# EAGLE design WaterTemp (EAGLE 9.5.0)
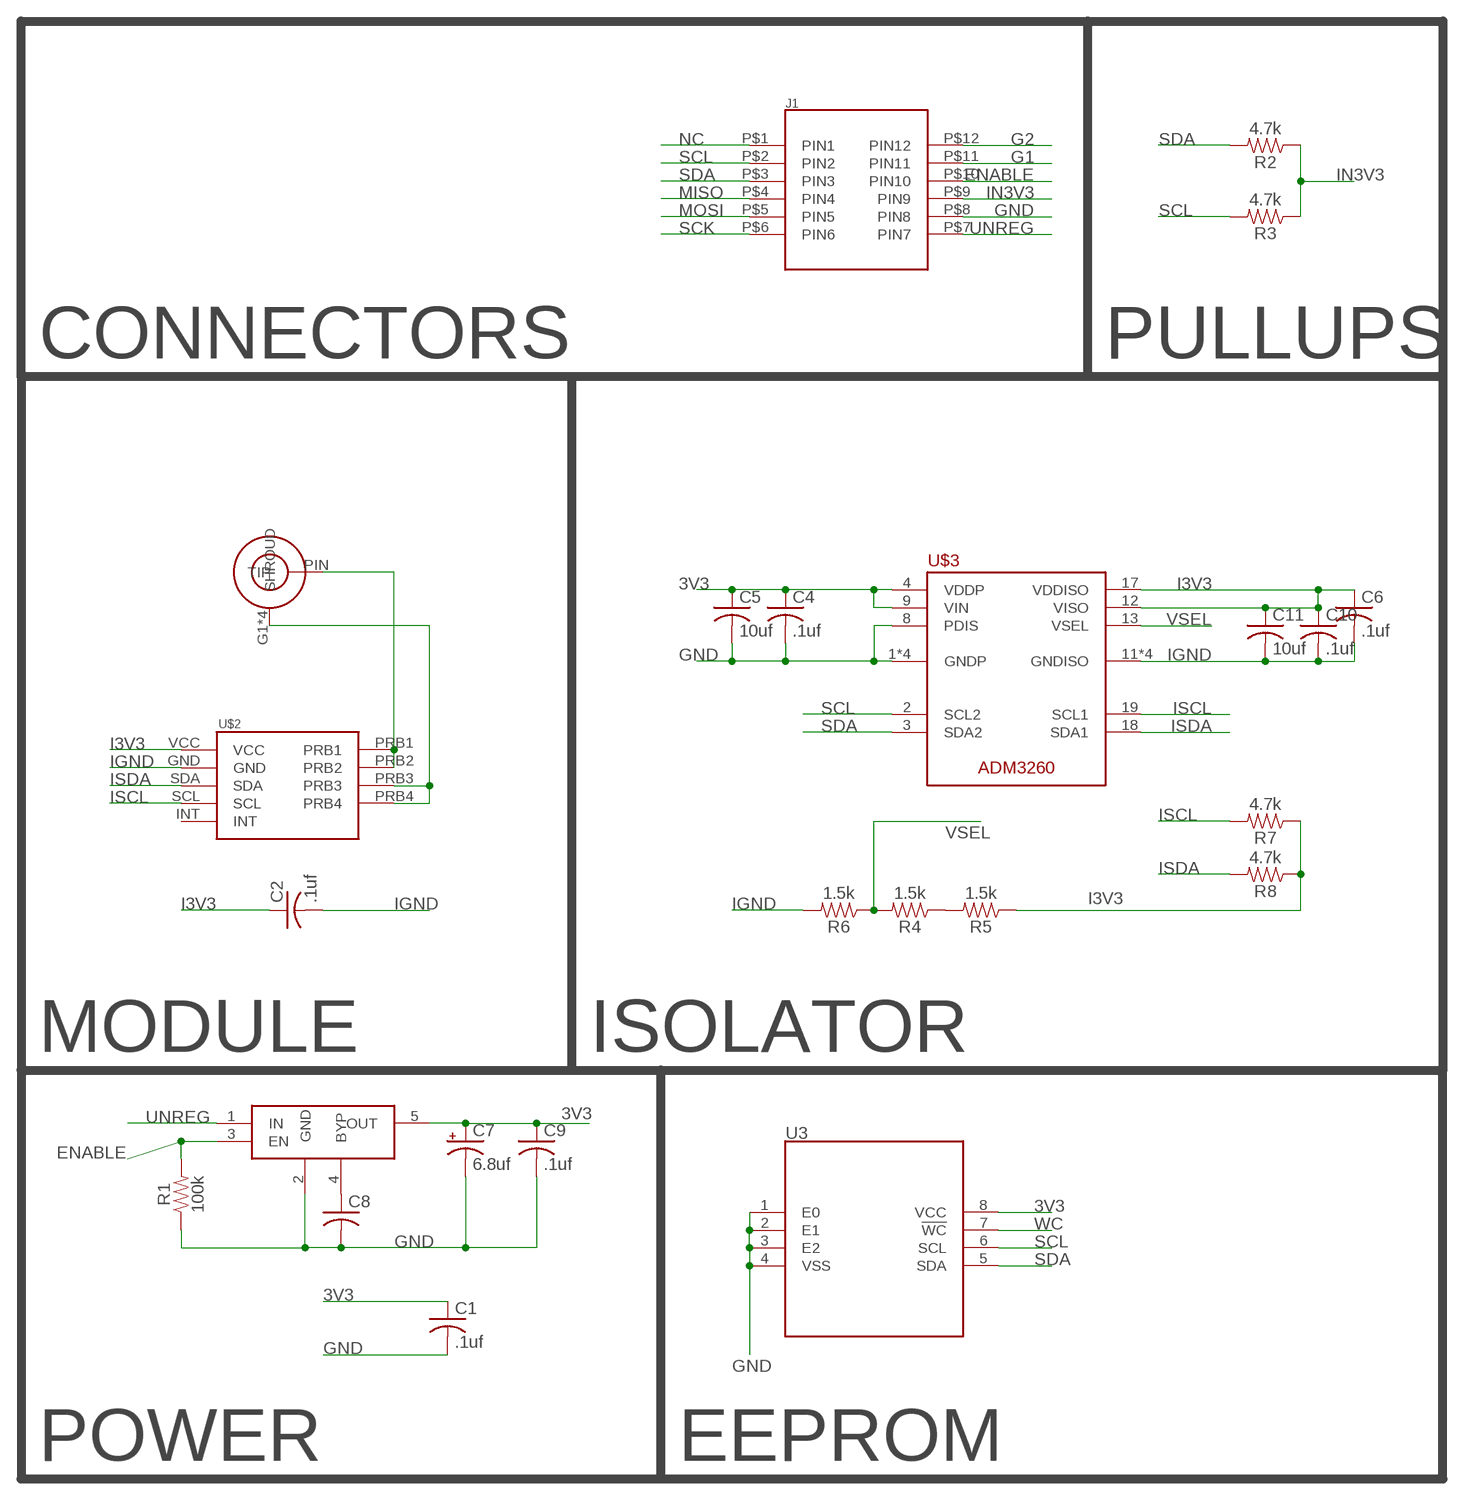
[diagram p0: schematic, sheet 1]

## Parts
C1  .1uf  C-USC0603K  [C0603K]
C2  .1uf  C-USC0603K  [C0603K]
C4  .1uf  C-USC0603K  [C0603K]
C5  10uf  C-USC0603K  [C0603K]
C6  .1uf  C-USC0603K  [C0603K]
C7  6.8uf  CPOL-USA/3216-18R  [A/3216-18R]
C8  C-USC0603K  [C0603K]
C9  .1uf  C-USC0603K  [C0603K]
C10  .1uf  C-USC0603K  [C0603K]
C11  10uf  C-USC0603K  [C0603K]
J1  2X6-HEADERS  [M20-7810645]
R1  100k  100KOHM-0603-1/10W-1%  [0603]
R2  4.7k  100KOHM-0603-1/10W-1%  [0603]
R3  4.7k  100KOHM-0603-1/10W-1%  [0603]
R4  1.5k  100KOHM-0603-1/10W-1%  [0603]
R5  1.5k  100KOHM-0603-1/10W-1%  [0603]
R6  1.5k  100KOHM-0603-1/10W-1%  [0603]
R7  4.7k  100KOHM-0603-1/10W-1%  [0603]
R8  4.7k  100KOHM-0603-1/10W-1%  [0603]
U3  M24C02-WMN6TP  [SOIC127P600X175-8]
U$1  5-1814832-1  [5-1814832-1]
U$2  ATLAS12P  [ATLAS-12P]
U$3  ADM3260  [SOP65P780X200-20]
U$4  MIC5219-3.3YM5-TR  [SOT95P280X145-5]

## Nets
3V3: C1.1 C4.1 C5.1 C7.+ C9.1 U3.8(VCC) U$3.4(VDDP) U$3.9(VIN) U$4.5(OUT)
ENABLE: J1.P$10(PIN10) R1.2 U$4.3(EN)
G1: J1.P$11(PIN11)
G2: J1.P$12(PIN12)
GND: C1.2 C4.2 C5.2 C7.- C8.2 C9.2 J1.P$8(PIN8) R1.1 U3.1(E0) U3.2(E1) U3.3(E2) U3.4(VSS) U$3.1(GNDP) U$3.5(GNDP) U$3.7(GNDP) U$3.8(PDIS) U$3.10(GNDP) U$4.2(GND)
I3V3: C2.1 C6.1 C10.1 C11.1 R5.1 R7.1 R8.1 U$2.VCC U$3.12(VISO) U$3.17(VDDISO)
IGND: C2.2 C6.2 C10.2 C11.2 R6.2 U$2.GND U$3.11(GNDISO) U$3.14(GNDISO) U$3.16(GNDISO) U$3.20(GNDISO)
IN3V3: J1.P$9(PIN9) R2.1 R3.1
ISCL: R7.2 U$2.SCL U$3.19(SCL1)
ISDA: R8.2 U$2.SDA U$3.18(SDA1)
MISO: J1.P$4(PIN4)
MOSI: J1.P$5(PIN5)
N$2: U$1.PIN(TIP) U$2.PRB1 U$2.PRB2
N$3: R4.1 R5.2
N$6: C8.1 U$4.4(BYP)
NC: J1.P$1(PIN1)
PG: U$1.G1(SHROUD) U$1.G2(SHROUD) U$1.G3(SHROUD) U$1.G4(SHROUD) U$2.PRB3 U$2.PRB4
SCK: J1.P$6(PIN6)
SCL: J1.P$2(PIN2) R3.2 U3.6(SCL) U$3.2(SCL2)
SDA: J1.P$3(PIN3) R2.2 U3.5(SDA) U$3.3(SDA2)
UNREG: J1.P$7(PIN7) U$4.1(IN)
VSEL: R4.2 R6.1 U$3.13(VSEL)
WC: U3.7(!WC)
Unconnected: U$2.INT

## Notes on the sheet
- CONNECTORS | PULLUPS
- MODULE | ISOLATOR
- POWER | EEPROM

## Library data of the parts
C1 C2 C4-C6 C8-C11 = rcl:C-US: CAPACITOR, American symbol; SPICEPREFIX: C
C7 = rcl:CPOL-US: POLARIZED CAPACITOR, American symbol; SPICEPREFIX: C
J1 = Conservify:2X6-HEADERS
R1 = SparkFun-Resistors:100KOHM: 100kΩ resistor A resistor is a passive two-terminal electrical component that implements electrical resistance as a circuit element. Resistors act to reduce current flow, and, at the same time, act to lower voltage levels within circuits. - Wikipedia; PROD_ID: RES-07828
R2-R8 = SparkFun-Resistors:100KOHM: 100kΩ resistor A resistor is a passive two-terminal electrical component that implements electrical resistance as a circuit element. Resistors act to reduce current flow, and, at the same time, act to lower voltage levels within circuits. - Wikipedia; PROD_ID: RES-07828; VALUE: 100k
U3 = Conservify:M24C02-WMN6TP
U$1 = Conservify:5-1814832-1
U$2 = Conservify:ATLAS12P
U$3 = Conservify:ADM3260
U$4 = Conservify:MIC5219-3.3YM5-TR

## Board
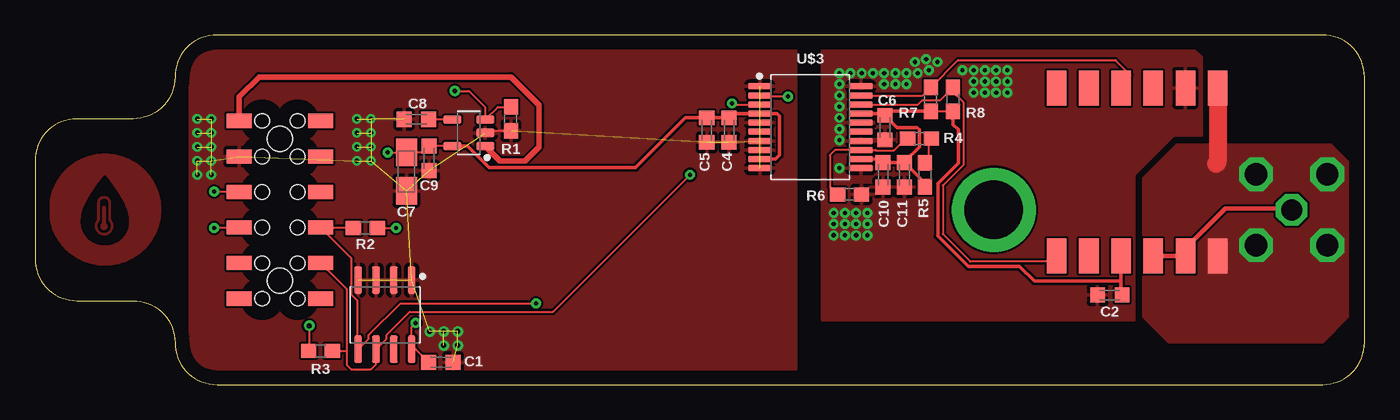
[diagram p1: board, top side]
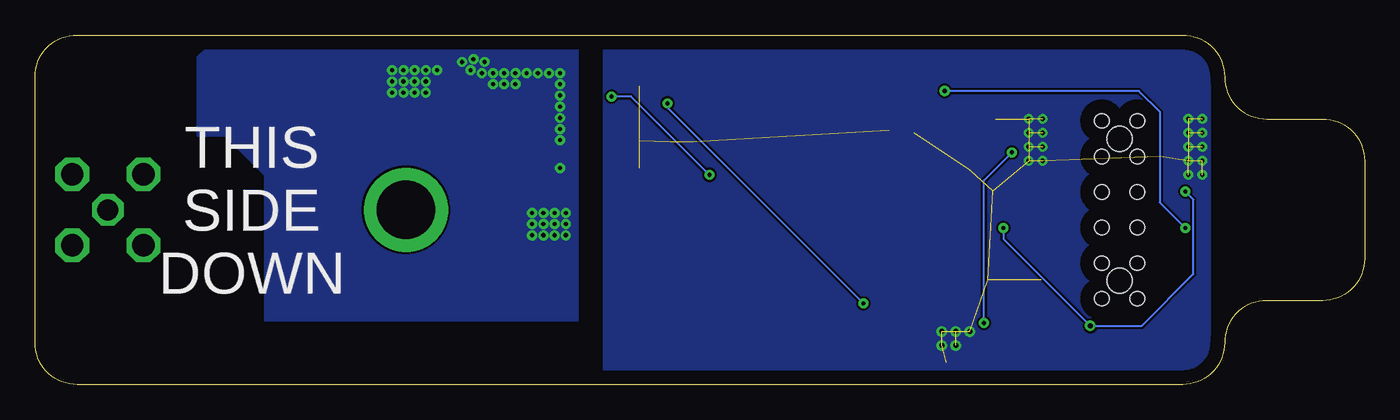
[diagram p2: board, bottom side, seen from below]

Size 95 x 25 mm. Coordinates in mm from the lower left corner, seen from the top.
Outline: 92,0 arc90 95,3 95,22 arc90 92,25 13,25 arc90 10,22 arc-90 7,19 3,19 arc90 0,16 0,9 arc90 3,6 7,6 arc-90 10,3 arc90 13,0 92,0
Copper layers (1*16): Top 0.035mm / dielectric 1.5mm / Bottom 0.035mm
Design rules "default *": minimum track width 6mil, minimum drill 0.3mm, track to track 6mil, track to pad 6mil, pad to pad 6mil, via to via 6mil, smd to smd 6mil, copper to edge 40mil, drill to drill 6mil, minimum pad ring 10mil, minimum via ring 8mil, stop-mask expansion 4mil, vias tented up to drill 0.3mm, thermal gap 10mil

### Footprints (pad centres in the part's own frame; a part is rotated, then mirrored left to right if it is on the bottom)
C0603K = smd 1.05 x 1.08: 1 -0.875,0; 2 0.875,0
A/3216-18R = smd 1.95 x 1.5: + 1.375,0; - -1.375,0
M20-7810645 = smd 1.02 x 1.78: P$1 -6.35,-2.91; P$2 -3.81,-2.91; P$3 -1.27,-2.91; P$4 1.27,-2.91; P$5 3.81,-2.91; P$6 6.35,-2.91; P$7 6.35,2.91; P$8 3.81,2.91; P$9 1.27,2.91; P$10 -1.27,2.91; P$11 -3.81,2.91; P$12 -6.35,2.91 | hole 1.02: -6.35,1.27; -3.81,1.27; -1.27,1.27; 1.27,1.27; 3.81,1.27; 6.35,1.27; 6.35,-1.27; 3.81,-1.27; 1.27,-1.27; -1.27,-1.27; -3.81,-1.27; -6.35,-1.27 | hole 1.8: -5.08,0; 5.08,0
0603 = smd 1.1 x 1: 1 -0.85,0; 2 0.85,0
SOIC127P600X175-8 = smd 1.968 x 0.569: 1 -2.473,1.905; 2 -2.473,0.635; 3 -2.473,-0.635; 4 -2.473,-1.905; 5 2.473,-1.905; 6 2.473,-0.635; 7 2.473,0.635; 8 2.473,1.905
5-1814832-1 = drill 1.6 octagon: G1 -2.54,2.54; G2 -2.54,-2.54; G3 2.54,-2.54; G4 2.54,2.54 | drill 1.5 octagon: PIN 0,0
ATLAS-12P = smd 2.5 x 1.4: GND 6,-3.2; INT 6,-0.9; NC -6,3.7; NC2 6,3.7; NC3 6,6; PRB1 -6,-0.9; PRB2 -6,-3.2; PRB3 -6,-5.5; PRB4 6,-5.5; SCL 6,1.4; SDA -6,6; VCC -6,1.4
SOP65P780X200-20 = smd 1.702 x 0.475: 1 -3.603,2.925; 2 -3.603,2.275; 3 -3.603,1.625; 4 -3.603,0.975; 5 -3.603,0.325; 6 -3.603,-0.325; 7 -3.603,-0.975; 8 -3.603,-1.625; 9 -3.603,-2.275; 10 -3.603,-2.925; 11 3.603,-2.925; 12 3.603,-2.275; 13 3.603,-1.625; 14 3.603,-0.975; 15 3.603,-0.325; 16 3.603,0.325; 17 3.603,0.975; 18 3.603,1.625; 19 3.603,2.275; 20 3.603,2.925
SOT95P280X145-5 = smd 1.262 x 0.609: 1 -1.175,0.95; 2 -1.175,0; 3 -1.175,-0.95; 4 1.175,-0.95; 5 1.175,0.95

### Placement (x,y rotation side)
C1  29,1.6 0 top
C2  76.8,6.4 180 top
C4  49.6,18.2 270 top
C5  48,18.2 270 top
C6  60.73,18.38 270 top
C7  26.54,15.23 90 top
C8  27.25,18.97 180 top
C9  28.17,16.18 270 top
C10  60.6,15 270 top
C11  62.13,15 270 top
J1  17.5,12.5 90 top
R1  34,19 90 top
R2  23.6,11.2 180 top
R3  20.4,2.4 0 top
R4  63.2,17.6 180 top
R5  63.6,15 90 top
R6  58.2,13.6 0 top
R7  64,20.4 90 top
R8  65.6,20.4 90 top
U3  25,5 270 top
U$1  89.8,12.5 0 top
U$2  79,15.2 90 top
U$3  55.4,18.4 0 top
U$4  31,18 180 top

### Tracks (layer width: path | path; a pad name or v marks a point on that pad's centre or on a via)
3V3  (via drill 0.3)
  Top 0.152: 29.95,17.05 U$4.5 C9.1 27.73,16.61 C7.+ v25.21,16.61 v25.2,16.6 | C1.1 27.2,2.53 | 27.2,2.53 27,2.73 | 27.2,2.53 U3.8 26.91,4.11 v27.2,4.4
  Top 0.254: U$3.9 52.92,16.12 53.2,16.4 53.2,19.2 53.02,19.38 U$3.4 49.9,19.38 C4.1 C5.1 46.48,19.07 42.92,15.52 32.45,15.52 30.92,17.05 U$4.5
  Bottom 0.152: v27.2,4.4 27.2,14.6 v25.2,16.6
ENABLE  (via drill 0.3, 0.35)
  Top 0.152: R1.2 33.08,19.85 U$4.3 32.17,19.82 31,21 v30,21 | v12.8,11.2 12.83,11.23 J1.P$10
  Bottom 0.152: v30,21 16.11,21 14.63,19.51 14.63,13.03 v12.8,11.2
GND  (via drill 0.3, 0.35)  (39 unrouted)
  Top 0.152: U$4.2 32.33,18.15 R1.1
  other vias: 23,19 24,19 24,18 23,18 24,17 23,17 24,16 11.6,19 11.6,18 11.6,17 11.6,16 11.6,15 12.6,19 12.6,18 12.6,17 12.6,16 12.6,15 30.2,3.8 28.2,3.8 29.2,3.8 29.2,2.8 30.2,2.8 23,16
  pour Top: 11,24 54.4,24 54.4,1 11,1
  pour Bottom: 11,24 54.4,24 54.4,1 11,1
GND1
  pour Top (rank 3): 6.59,12.51 6.65,12.3 6.68,12.21 6.7,12.11 6.72,12.01 6.73,11.91 6.73,11.81 6.74,11.63 6.73,11.53 6.73,11.44 6.72,11.35 6.7,11.27 6.68,11.18 6.65,11.1 6.63,11.02 6.59,10.94 6.56,10.86 6.52,10.79 6.47,10.72 6.42,10.65 6.37,10.58 6.32,10.51 6.26,10.45 6.2,10.4 6.14,10.34 6.07,10.29 6,10.24 5.93,10.19 5.86,10.15 5.78,10.11 5.7,10.08 5.62,10.05 5.54,10.02 5.45,10 5.36,9.98 5.27,9.96 5.18,9.95 5.09,9.94 4.99,9.94 4.9,9.94 4.8,9.95 4.71,9.96 4.62,9.98 4.54,10 4.45,10.02 4.37,10.05 4.28,10.08 4.2,10.11 4.13,10.15 4.05,10.19 3.98,10.24 3.91,10.29 3.84,10.34 3.78,10.4 3.72,10.45 3.66,10.51 3.61,10.58 3.56,10.65 3.51,10.72 3.47,10.79 3.43,10.86 3.39,10.94 3.36,11.02 3.33,11.1 3.3,11.18 3.28,11.27 3.27,11.35 3.25,11.44 3.25,11.53 3.24,11.63 3.25,11.79 3.25,11.89 3.26,11.98 3.28,12.08 3.3,12.18 3.32,12.28 3.39,12.51 1,12.51 1,12.5 1.01,12.3 1.02,12.1 1.05,11.9 1.08,11.7 1.13,11.5 1.18,11.31 1.24,11.13 1.31,10.95 1.4,10.77 1.48,10.6 1.58,10.43 1.68,10.27 1.8,10.11 1.91,9.96 2.04,9.81 2.17,9.67 2.31,9.54 2.46,9.42 2.61,9.3 2.77,9.18 2.93,9.08 3.1,8.98 3.27,8.89 3.45,8.81 3.63,8.74 3.82,8.68 4.01,8.63 4.2,8.58 4.4,8.55 4.6,8.52 4.8,8.51 5.01,8.5 5.21,8.51 5.42,8.52 5.62,8.55 5.81,8.58 6.01,8.63 6.2,8.68 6.39,8.74 6.57,8.81 6.74,8.9 6.92,8.98 7.08,9.08 7.25,9.18 7.4,9.3 7.56,9.41 7.7,9.54 7.84,9.67 7.97,9.81 8.1,9.96 8.22,10.11 8.33,10.27 8.43,10.43 8.53,10.6 8.62,10.77 8.7,10.95 8.77,11.13 8.83,11.32 8.89,11.51 8.93,11.7 8.97,11.9 8.99,12.1 9.01,12.3 9.01,12.51
  pour Top (rank 3): 4.91,14.95 4.92,14.97 4.94,14.98 4.96,14.99 4.98,14.99 5.01,14.99 5.03,14.98 5.06,14.97 5.07,14.95 5.42,14.51 5.85,13.91 6.05,13.6 6.24,13.28 6.4,12.97 6.47,12.82 6.54,12.66 6.59,12.51 9.01,12.51 9.01,12.71 8.99,12.92 8.97,13.12 8.93,13.31 8.89,13.51 8.83,13.7 8.77,13.88 8.7,14.07 8.62,14.24 8.53,14.42 8.43,14.58 8.33,14.75 8.22,14.9 8.1,15.06 7.97,15.2 7.84,15.34 7.7,15.47 7.55,15.6 7.4,15.72 7.25,15.83 7.08,15.93 6.92,16.03 6.74,16.12 6.57,16.2 6.38,16.27 6.2,16.33 6.01,16.39 5.81,16.43 5.62,16.47 5.42,16.49 5.21,16.51 5.01,16.51 4.8,16.51 4.6,16.49 4.4,16.47 4.2,16.43 4.01,16.39 3.81,16.33 3.63,16.27 3.45,16.2 3.27,16.12 3.1,16.03 2.93,15.93 2.77,15.83 2.61,15.72 2.46,15.6 2.31,15.47 2.17,15.34 2.04,15.2 1.91,15.05 1.8,14.9 1.68,14.75 1.58,14.58 1.48,14.42 1.4,14.24 1.31,14.07 1.24,13.88 1.18,13.7 1.13,13.51 1.08,13.31 1.05,13.12 1.02,12.92 1.01,12.71 1,12.51 3.39,12.51 3.45,12.66 3.51,12.81 3.66,13.12 3.83,13.44 4.02,13.75 4.45,14.36
  pour Top (rank 3): 4.68,11.31 4.69,11.26 4.7,11.22 4.71,11.2 4.72,11.18 4.75,11.14 4.77,11.12 4.79,11.1 4.81,11.09 4.85,11.07 4.87,11.07 4.89,11.06 4.93,11.06 4.98,11.06 5.02,11.07 5.04,11.08 5.06,11.09 5.1,11.12 5.13,11.15 5.15,11.19 5.17,11.23 5.18,11.27 5.18,11.31 5.18,11.35 5.18,11.38 5.17,11.4 5.15,11.44 5.14,11.46 5.12,11.48 5.09,11.5 5.05,11.53 5.05,12.51 4.81,12.51 4.81,11.53 4.78,11.51 4.76,11.49 4.74,11.47 4.72,11.44 4.7,11.41 4.69,11.38 4.68,11.35
  pour Top (rank 3): 5.05,12.66 5.05,12.68 5.05,12.7 5.04,12.71 5.04,12.73 5.03,12.74 5.01,12.75 4.99,12.77 4.97,12.78 4.96,12.78 4.93,12.78 4.9,12.78 4.88,12.77 4.87,12.76 4.84,12.75 4.83,12.73 4.82,12.71 4.81,12.69 4.81,12.67 4.81,12.51 5.05,12.51
  pour Top (rank 3): 4.33,11.08 4.37,11.01 4.39,10.97 4.42,10.93 4.45,10.89 4.48,10.86 4.53,10.81 4.59,10.77 4.63,10.75 4.67,10.72 4.72,10.71 4.76,10.69 4.81,10.68 4.86,10.67 4.9,10.67 4.96,10.66 5.03,10.67 5.1,10.68 5.14,10.7 5.19,10.72 5.23,10.74 5.27,10.76 5.33,10.8 5.37,10.83 5.4,10.86 5.44,10.89 5.47,10.93 5.49,10.97 5.53,11.03 5.55,11.08 5.57,11.13 5.58,11.17 5.59,11.24 5.6,11.29 5.6,11.36 5.6,11.41 5.58,11.48 5.57,11.52 5.55,11.59 5.53,11.63 5.5,11.69 5.47,11.73 5.42,11.79 5.42,12.51 5.26,12.51 5.26,12.5 5.26,11.72 5.3,11.68 5.34,11.64 5.36,11.61 5.39,11.56 5.41,11.51 5.42,11.45 5.43,11.4 5.44,11.36 5.44,11.32 5.44,11.27 5.43,11.23 5.42,11.19 5.41,11.16 5.39,11.1 5.37,11.07 5.34,11.03 5.3,10.98 5.28,10.96 5.25,10.93 5.22,10.91 5.19,10.89 5.14,10.87 5.09,10.85 5.05,10.84 5.02,10.83 4.96,10.82 4.94,10.82 4.9,10.83 4.85,10.83 4.81,10.84 4.78,10.85 4.73,10.88 4.7,10.89 4.67,10.91 4.64,10.93 4.61,10.96 4.57,11 4.54,11.04 4.52,11.07 4.5,11.11 4.48,11.16 4.46,11.2 4.46,11.23 4.45,11.27 4.45,11.31 4.45,11.34 4.45,11.38 4.45,11.42 4.46,11.47 4.48,11.52 4.51,11.58 4.53,11.61 4.55,11.64 4.59,11.68 4.62,11.72 4.62,12.51 4.62,12.51 4.46,12.51 4.46,12.5 4.46,11.79 4.42,11.73 4.39,11.69 4.35,11.63 4.34,11.59 4.32,11.54 4.31,11.5 4.29,11.43 4.29,11.38 4.29,11.31 4.29,11.24 4.31,11.17 4.32,11.12
  pour Top (rank 3): 4.62,12.98 4.63,13.03 4.63,13.07 4.64,13.12 4.65,13.15 4.67,13.17 4.69,13.21 4.72,13.24 4.76,13.27 4.79,13.28 4.83,13.29 4.89,13.3 4.94,13.31 5,13.3 5.05,13.29 5.1,13.28 5.14,13.26 5.17,13.23 5.19,13.21 5.21,13.19 5.22,13.16 5.24,13.13 5.25,13.1 5.25,13.07 5.26,13.03 5.26,12.99 5.26,12.51 5.42,12.51 5.42,12.51 5.42,13 5.42,13.06 5.4,13.13 5.4,13.16 5.38,13.2 5.36,13.24 5.34,13.28 5.31,13.31 5.28,13.35 5.25,13.37 5.21,13.4 5.15,13.43 5.11,13.44 5.06,13.46 5.01,13.46 4.95,13.47 4.93,13.47 4.88,13.46 4.83,13.46 4.78,13.44 4.73,13.43 4.71,13.42 4.67,13.4 4.63,13.37 4.6,13.35 4.57,13.31 4.56,13.3 4.53,13.26 4.52,13.24 4.5,13.2 4.49,13.15 4.48,13.13 4.48,13.11 4.47,13.06 4.46,13 4.46,12.51 4.62,12.51
I3V3
  Top 0.152: 63.83,19.38 R7.1 R8.1 | 77.6,6.47 C2.1
  Top 0.254: R8.1 65.6,18.6 65.97,18.23 65.97,15.84 64.52,14.38 64.52,10.62 66.69,8.44 70.36,8.44 71.4,7.4 77.6,7.4 | 78.06,8.65 U$2.VCC 77.6,7.4 | U$3.12 60.35,16.12 C10.1 C11.1 | C6.1 61.6,18.38 63.02,18.38 63.18,18.22 63.18,16.98 62.13,15.93 C11.1 | C11.1 63.6,14.4 R5.1 | U$3.17 60.61,19.38 C6.1 | C6.1 61.03,19.55 R7.1 | 77.6,7.4 77.6,6.47
IGND  (via drill 0.3)
  other vias: 57.47,15.47 57.47,17.47 57.47,18.27 57.47,19.07 57.47,19.87 57.47,20.67 57.47,21.47 57.07,12.27 57.87,12.27 58.67,12.27 59.47,12.27 57.07,11.47 57.87,11.47 58.67,11.47 57.07,10.67 59.47,11.47 58.27,22.27 59.07,22.27 59.87,22.27 60.67,21.47 61.47,21.47 62.27,21.47 60.67,22.27 61.47,22.27 62.27,22.27 57.47,22.27 63.07,22.27 63.87,22.47 63.67,23.27 64.47,23.07 62.87,23.07 66.27,22.47 67.07,22.47 67.87,22.47 68.67,22.47 69.47,22.47 67.07,21.67 67.87,21.67 68.67,21.67 69.47,21.67 67.07,20.87 67.87,20.87 68.67,20.87 69.47,20.87 57.87,10.67 58.67,10.67 59.47,10.67
  pour Bottom: 56.2,4.6 56.2,24 82.8,24 83.4,23.4 83.4,17.8 81.4,17.8 78.6,15 78.6,4.6
  pour Top: 83.4,17.8 83.4,23.4 82.8,24 56.2,24 56.2,4.6 78.6,4.6 78.6,15 81.4,17.8
IN3V3  (via drill 0.3, 0.35)
  Top 0.152: v19.6,4.2 19.6,2.45 R3.1 | R2.1 v25.8,11.2 | v12.8,13.8 14.56,13.8 J1.P$9
  Bottom 0.152: v25.8,11.2 25.8,10.4 v19.6,4.2 15.91,4.2 12.22,7.9 12.22,13.22 v12.8,13.8
ISCL
  Top 0.152: U$3.19 63.42,20.68 R7.2 65.95,23.2 77.2,23.2 78.27,22.13 U$2.SCL
ISDA
  Top 0.152: U$3.18 63.1,20.02 63.41,20.33 64.68,20.33 R8.2 65.6,20.92 66.33,20.2 66.33,15.7 64.87,14.24 64.87,10.76 66.83,8.8 73.6,8.8 U$2.SDA
N$1  (via drill 4.2 pad 6)
  other vias: 68.5,12.5
N$2
  Top 0.305: U$2.PRB1 U$2.PRB2 82.2,9.72 85.06,12.57 89.73,12.57 U$1.PIN
N$3
  Top 0.152: R4.1 63.85,17.4 63.85,16.1 R5.2
N$6
  Top 0.152: C8.1 29.81,18.97 U$4.4
PG
  Top 1.27: U$2.PRB4 84.5,15.9 84.4,15.8
  pour Top (no thermals): 79.2,4.8 79.2,14.8 81.6,17.2 92.6,17.2 93.8,16 93.8,4.8 92,3 81,3
SCL  (via drill 0.3)
  Top 0.152: J1.P$2 22.28,6.82 22.28,2.42 | 22.28,2.42 22.28,1.42 22.6,1.1 22.6,1.09 24,1.09 24.37,1.46 U3.6 25.12,3.28 25.12,3.54 26.78,5.2 37,5.2 v46.8,15 | R3.2 22.26,2.4 22.28,2.42 | v53.8,20.6 51.87,20.6 U$3.2
  Bottom 0.152: v46.8,15 52.4,20.6 v53.8,20.6
SDA  (via drill 0.3)
  Top 0.152: R2.2 22.72,11.23 J1.P$3 22.58,9.06 22.58,6.46 23.02,6.02 23.02,2.6 U3.5 23.85,3.28 23.85,3.54 26.11,5.8 v35.8,5.8 | v49.8,20.11 49.88,20.02 U$3.3
  Bottom 0.152: v35.8,5.8 49.8,19.8 v49.8,20.11
UNREG
  Top 0.406: J1.P$7 14.59,20.59 16,22 34,22 36,20 36,17 35,16 33.23,16 U$4.1
VSEL
  Top 0.152: R4.2 62.22,17.6 61.37,16.75 60.1,16.75 60.07,16.77 U$3.13 57.17,16.77 56.8,16.4 56.8,14.15 R6.1

### Text on the board
bPlace: THIS / SIDE / DOWN